# EAGLE schematic SPSTrelay_nice_layout (EAGLE 8.3.2)
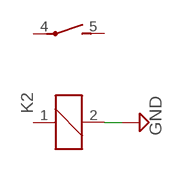
[diagram p0: schematic, sheet 1]

## Parts
K2  HF41F-12-H  [HF41F-12-H]

## Nets
GND: K2.2
Unconnected: K2.1 K2.4(P) K2.5(S)

## Library data of the parts
K2 = relay_computer_custom:HF41F-12-H: SPST RELAY Relay SPST 5mm x 28mm HONGFA